# EAGLE design BQ29209 breakout board V1.1 (EAGLE 7.6.0)
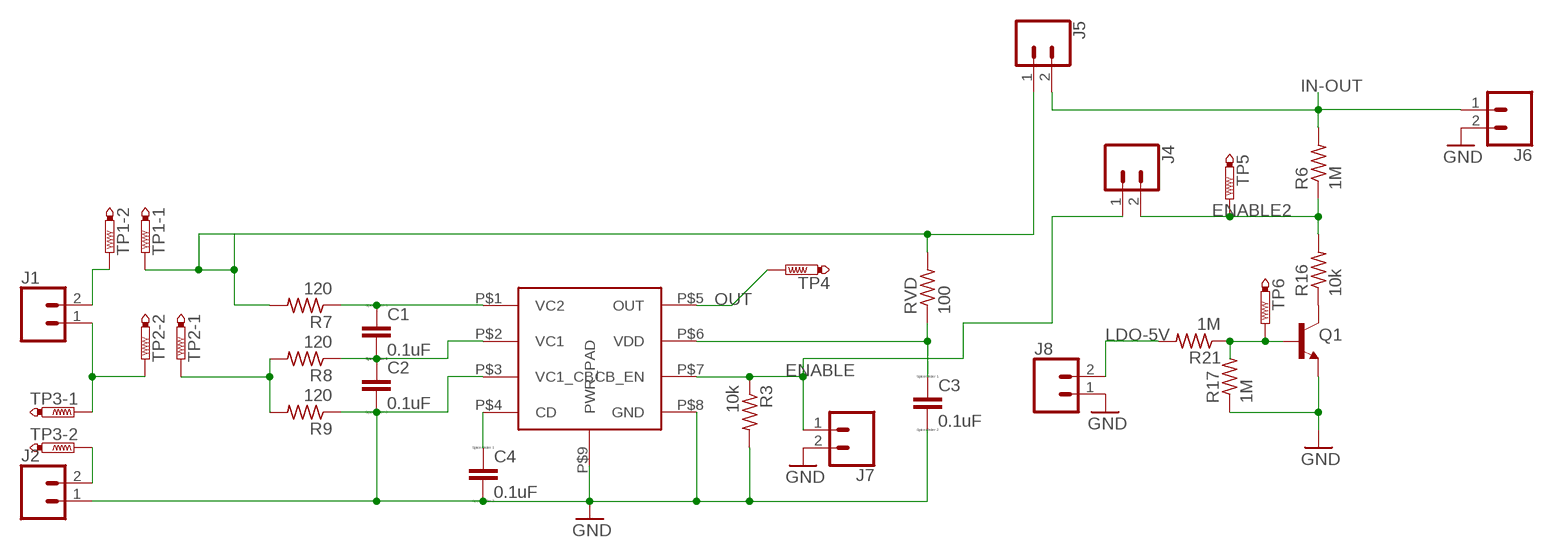
[diagram p0: schematic, sheet 1]

## Parts
C1  0.1uF  C  [C0805]
C2  0.1uF  C  [C0805]
C3  0.1uF  C  [C0805]
C4  0.1uF  C  [C0805]
J1  CONN_02  [1X02]
J2  CONN_02  [1X02]
J4  CONN_02  [1X02]
J5  CONN_02  [1X02]
J6  CONN_02  [1X02]
J7  CONN_02  [1X02]
J8  CONN_02  [1X02]
Q1  TRANS_NPN-MMBT2222AL  [SOT23-3]
R3  10k  R-US_R0805  [R0805]
R6  1M  R-US_R0805  [R0805]
R7  120  R-US_R0805  [R0805]
R8  120  R-US_R0805  [R0805]
R9  120  R-US_R0805  [R0805]
R16  10k  R-US_R0805  [R0805]
R17  1M  R-US_M0805  [M0805]
R21  1M  R-US_M0805  [M0805]
RVD  100  R-US_R0805  [R0805]
TP1  PTR2  [P2-38-17]
TP2  PTR2  [P2-38-17]
TP3  PTR2  [P2-38-17]
TP4  PTR1PAD1-13Y  [P1-13Y]
TP5  PTR1PAD1-13Y  [P1-13Y]
TP6  PTR1PAD1-13Y  [P1-13Y]
U$8  BQ29209  [VSON8]

## Nets
BASE: Q1.1(B) R17.2 R21.1 TP6.TP
ENABLE: J4.1 J7.1 R3.1 U$8.P$7(CB_EN)
ENABLE2: J4.2 R6.1 R16.2 TP5.TP
GND: C2.2 C3.2 C4.2 J2.1 J6.2 J7.2 J8.1 Q1.2(E) R3.2 R9.1 R17.1 U$8.P$3(VC1_CB) U$8.P$8(GND) U$8.P$9(PWR_PAD)
IN-OUT: J5.2 J6.1 R6.2
LDO-5V: J8.2 R21.2
N$1: J1.2 TP1.TP-2
N$2: R8.2 R9.2 TP2.TP-1
N$3: J1.1 TP2.TP-2 TP3.TP-1
N$4: C1.1 R7.1 U$8.P$1(VC2)
N$5: C1.2 C2.1 R8.1 U$8.P$2(VC1)
N$6: C3.1 RVD.1 U$8.P$6(VDD)
N$7: Q1.3(C) R16.1
N$8: C4.1 U$8.P$4(CD)
N$9: J2.2 TP3.TP-2
OUT: TP4.TP U$8.P$5(OUT)
V-BATT: J5.1 R7.2 RVD.2 TP1.TP-1

## Library data of the parts
C1-C4 = eagle-ltspice:C: CAPACITOR, European symbol; SPICEMODEL: NONE; SPICEPREFIX: C
J1 J2 J4-J8 = SparkFun-Connectors:CONN_02: Multi connection point. Often used as Generic Header-pin footprint for 0.1 inch spaced/style header connections On any of the 0.1 inch spaced packages, you can populate with these: Break Away Headers - Straight <https://www.sparkfun.com/products/116> (PRT-00116) Break Away Male Headers - Right Angle <https://www.sparkfun.com/products/553> (PRT-00553) Female Headers <https://www.sparkfun.com/products/115> (PRT-00115) Break Away Headers - Machine Pin <https://www.sparkfun.com/products/117> (PRT-00117) Break Away Female Headers - Swiss Machine Pin <https://www.sparkfun.com/products/743> (PRT-00743) For SCREWTERMINALS and SPRING TERMINALS visit here: Screw Terimnals on SparkFun.com <https://www.sparkfun.com/search/results?term=Screw+Terminals> (5mm/3.5mm/2.54mm spacing) This device is also useful as a general connection point to wire up your design to another part of your project. Our various solder wires solder well into these plated through hole pads. Hook-Up Wire - Assortment (Stranded, 22 AWG) <https://www.sparkfun.com/products/11375> (PRT-11375) Hook-Up Wire - Assortment (Solid Core, 22 AWG) <https://www.sparkfun.com/products/11367> (PRT-11367) View the entire wire category on our website here <https://www.sparkfun.com/categories/141> Special notes: Molex polarized connector foot print use with: PRT-08233 with associated crimp pins and housings. 2.54_SCREWTERM for use with PRT-10571. 3.5mm Screw Terminal footprints for PRT-08084 5mm Screw Terminal footprints for use with PRT-08432
Q1 = SparkFun-DiscreteSemi:TRANS_NPN: NPN transistor Current controlled devices typically used to amplify current or used as a switch. BC547 - COM-08928 <http://www.sparkfun.com/products/8928> (TO-92 45V 100mA) (1.Collector 2.Base 3.Emitter) 2N3904 - COM-00521 <http://www.sparkfun.com/products/521> (TO-92 40V 200mA) (1.Emitter 2.Base 3.Collector) P2N2222A - COM-12852 <http://www.sparkfun.com/products/12852> (TO-92 40V 600mA) (1.Collector 2.Base 3.Emitter); PROD_ID: TRANS-08049; VALUE: 600mA/40V
R3 R6-R9 R16 R17 R21 RVD = rcl:R-US_: RESISTOR, American symbol
TP1-TP3 = testpad:PTR2: TEST PIN
TP4-TP6 = testpad:PTR1: TEST PIN
U$8 = Parts for Power Team1:BQ29209

## Board
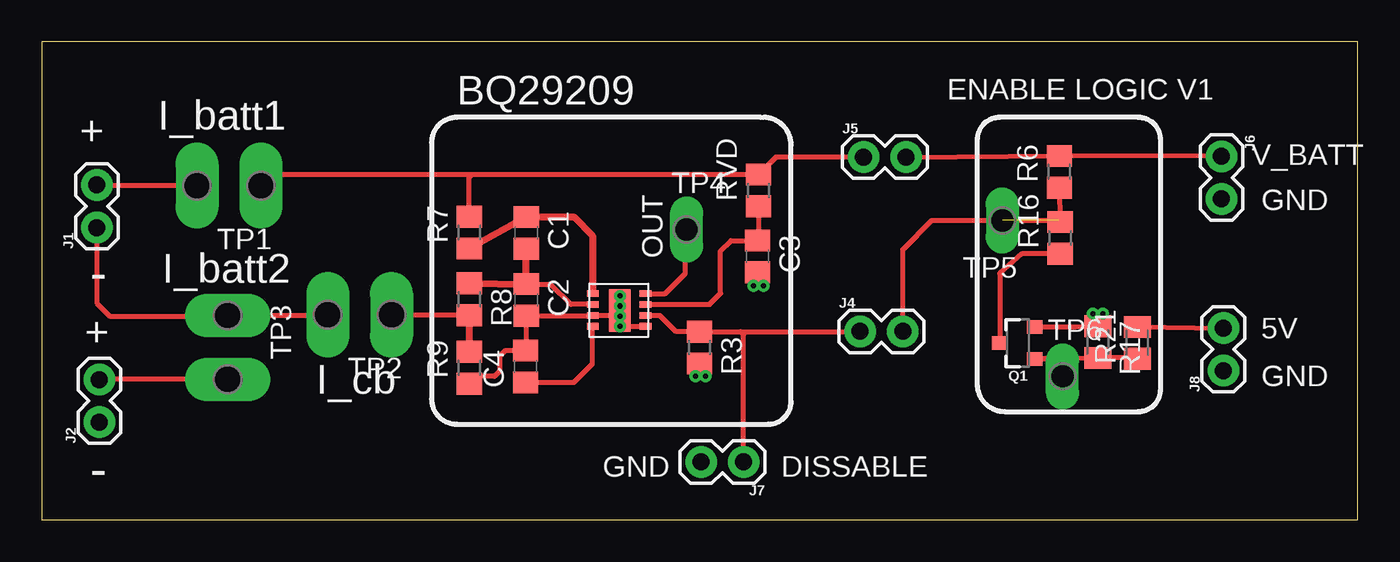
[diagram p1: board, top side]
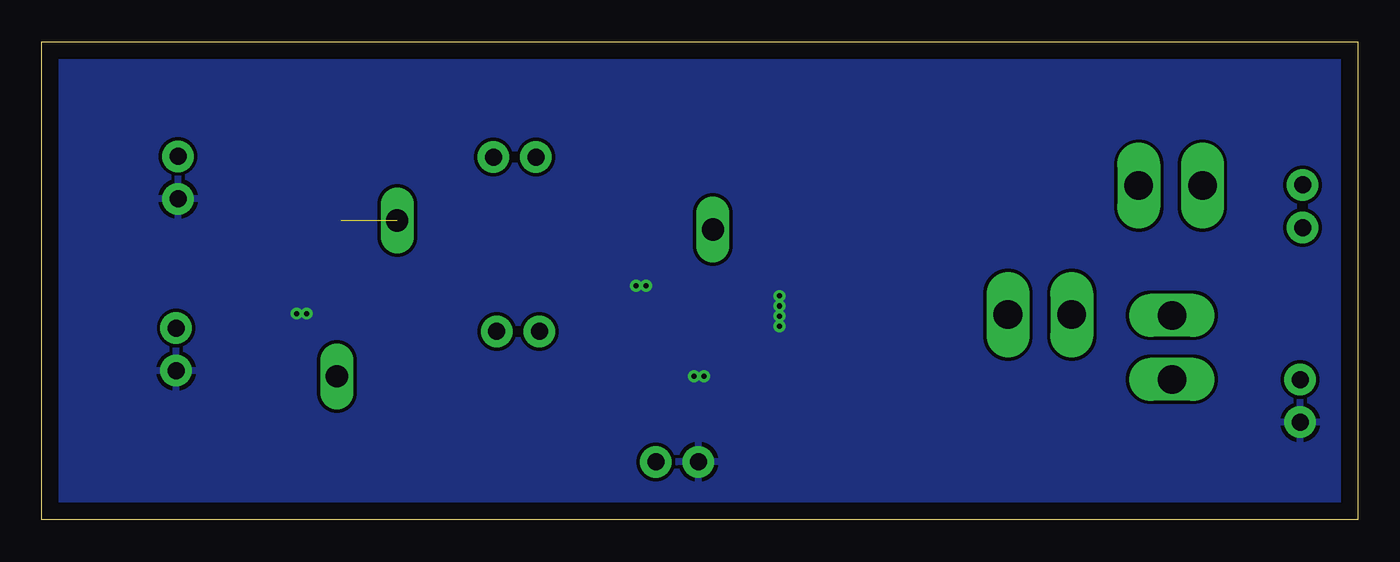
[diagram p2: board, bottom side, seen from below]

Size 78.5 x 28.5 mm. Coordinates in mm from the lower left corner, seen from the top.
Outline: 0,0 78.5,0 78.5,28.5 0,28.5 0,0
Copper layers (1*16): Top 0.035mm / dielectric 1.5mm / Bottom 0.035mm
Design rules "default": minimum track width 10mil, minimum drill 24mil, track to track 8mil, track to pad 8mil, pad to pad 8mil, via to via 8mil, smd to smd 8mil, copper to edge 40mil, drill to drill 8mil, minimum pad ring 10mil, minimum via ring 8mil, stop-mask expansion 4mil, vias tented up to drill 0mil, thermal gap 10mil

### Footprints (pad centres in the part's own frame; a part is rotated, then mirrored left to right if it is on the bottom)
C0805 = smd 1.3 x 1.5: 1 -0.95,0; 2 0.95,0
1X02 = drill 1.016 pad 1.88: 1 0,0; 2 2.54,0
SOT23-3 = smd 0.8 x 0.9: 1 -0.95,-1; 2 0.95,-1; 3 0,1.1
R0805 = smd 1.3 x 1.5: 1 -0.95,0; 2 0.95,0
M0805 = smd 1.3 x 1.6: 1 -0.95,0; 2 0.95,0
P2-38-17 = drill 1.702 pad 2.121 long: TP-1 -1.905,0; TP-2 1.905,0
P1-13Y = drill 1.321 pad 1.905 long: TP 0,0
VSON8 = smd 0.4 x 0.7: P$1 0,0; P$2 0.65,0; P$3 1.3,0; P$4 1.95,0; P$5 0,3.15; P$6 0.65,3.15; P$7 1.3,3.15; P$8 1.95,3.15 | smd 2.54 x 1.27: P$9 1,1.6

### Placement (x,y rotation side)
C1  28.9,17.11 270 top
C2  28.9,13.11 270 top
C3  42.7,15.71 270 top
C4  28.85,9.14 90 top
J1  3.28,17.43 90 top
J2  3.43,5.82 90 top
J4  48.82,11.23 0 top
J5  49.02,21.63 0 top
J6  70.38,21.68 270 top
J7  41.87,3.45 180 top
J8  70.49,8.89 90 top
Q1  58.23,10.54 90 top
R3  39.23,10.27 270 top
R6  60.7,20.75 90 top
R7  25.5,17.13 90 top
R8  25.5,13.15 270 top
R9  25.5,9.07 90 top
R16  60.75,16.81 90 top
R17  63,10.6 270 top
R21  65.35,10.55 90 top
RVD  42.75,19.64 90 top
TP1  11.16,19.93 180 top
TP2  18.96,12.23 180 top
TP3  11.08,10.28 270 top
TP4  38.46,17.31 0 top
TP5  57.3,17.85 180 top
TP6  60.9,8.55 0 top
U$8  32.87,13.49 270 top

### Tracks (layer width: path | path; a pad name or v marks a point on that pad's centre or on a via)
BASE
  Top 0.305: R21.1 64.6,9.65 R17.2 61.59,9.59 Q1.1 60.16,9.59 TP6.TP
ENABLE
  Top 0.305: U$8.P$7 36.86,12.19 37.8,11.25 39.2,11.25 R3.1 41.7,11.22 | 41.7,11.22 J4.1 48.8,11.25 | J7.1 41.87,11.05 41.7,11.22
ENABLE2  (1 unrouted)
  Top 0.305: J4.2 51.36,16.11 53.1,17.85 60.66,17.85 R16.2 R6.1
GND  (via drill 0.3)
  Top 0.305: R9.1 25.93,8.55 27,8.55 27.3,8.85 27.3,9.75 27.64,10.09 C4.2 28.9,10.14 C2.2 32.84,12.16 U$8.P$3 34.46,12.19 v34.5,12.15 | v34.5,12.75 34.5,12.52 U$8.P$9 | v34.5,11.55 U$8.P$8 | R3.2 39.23,8.78 v39,8.55 | C3.2 42.7,14.2 v42.45,13.95 | Q1.2 61.65,11.49 R17.1 63,12 v63.3,12.3
  other vias: 39.6,8.55 43.05,13.95 34.5,13.35 62.7,12.3
  pour Bottom: -1.27,-1.27 -1.27,53.34 78.74,53.34 78.74,0 1.27,0
IN-OUT
  Top 0.305: J6.1 R6.2 J5.2
LDO-5V
  Top 0.305: R21.2 J8.2
N$1
  Top 0.305: TP1.TP-2 3.32,19.93 J1.2
N$2
  Top 0.305: TP2.TP-1 25.47,12.23 R8.2
  Top 0.406: R8.2 R9.2
N$3
  Top 0.305: J1.1 3.28,12.92 4.05,12.15 11.04,12.15 TP3.TP-1 17.01,12.19 TP2.TP-2
N$4
  Top 0.406: U$8.P$1 32.85,13.51 32.85,16.95 31.74,18.06 C1.1 R7.1
N$5
  Top 0.305: C2.1 30.34,14.06 31.56,12.84 U$8.P$2
  Top 0.406: R8.1 C2.1 C1.2
N$6
  Top 0.305: U$8.P$6 39.84,12.84 40.5,13.5 40.5,16.05 41.1,16.65 C3.1 42.75,16.71 RVD.1
N$7
  Top 0.305: R16.1 58.46,15.86 57.15,14.7 57.15,10.56 Q1.3
N$8
  Top 0.305: C4.1 31.74,8.19 32.85,9.3 32.85,11.52 U$8.P$4
N$9
  Top 0.305: TP3.TP-2 3.44,8.38 J2.2
OUT
  Top 0.305: U$8.P$5 37.19,13.49 38.4,14.7 38.4,17.25 TP4.TP
V-BATT
  Top 0.305: J5.1 43.79,21.63 RVD.2 25.65,20.59 | 25.65,20.59 13.72,20.59 TP1.TP-1 | R7.2 25.5,20.44 25.65,20.59

### Text on the board
tSilk: BQ29209 | ENABLE LOGIC V1 | I_batt1 | + | V_BATT | GND | I_batt2 | OUT | - | 5V | + | I_cb | GND | GND | DISSABLE | -